# Altium schematic sheet MCU.SchDoc
size A3; DocumentNumber: 2; SheetNumber: 2; SheetTotal: 5
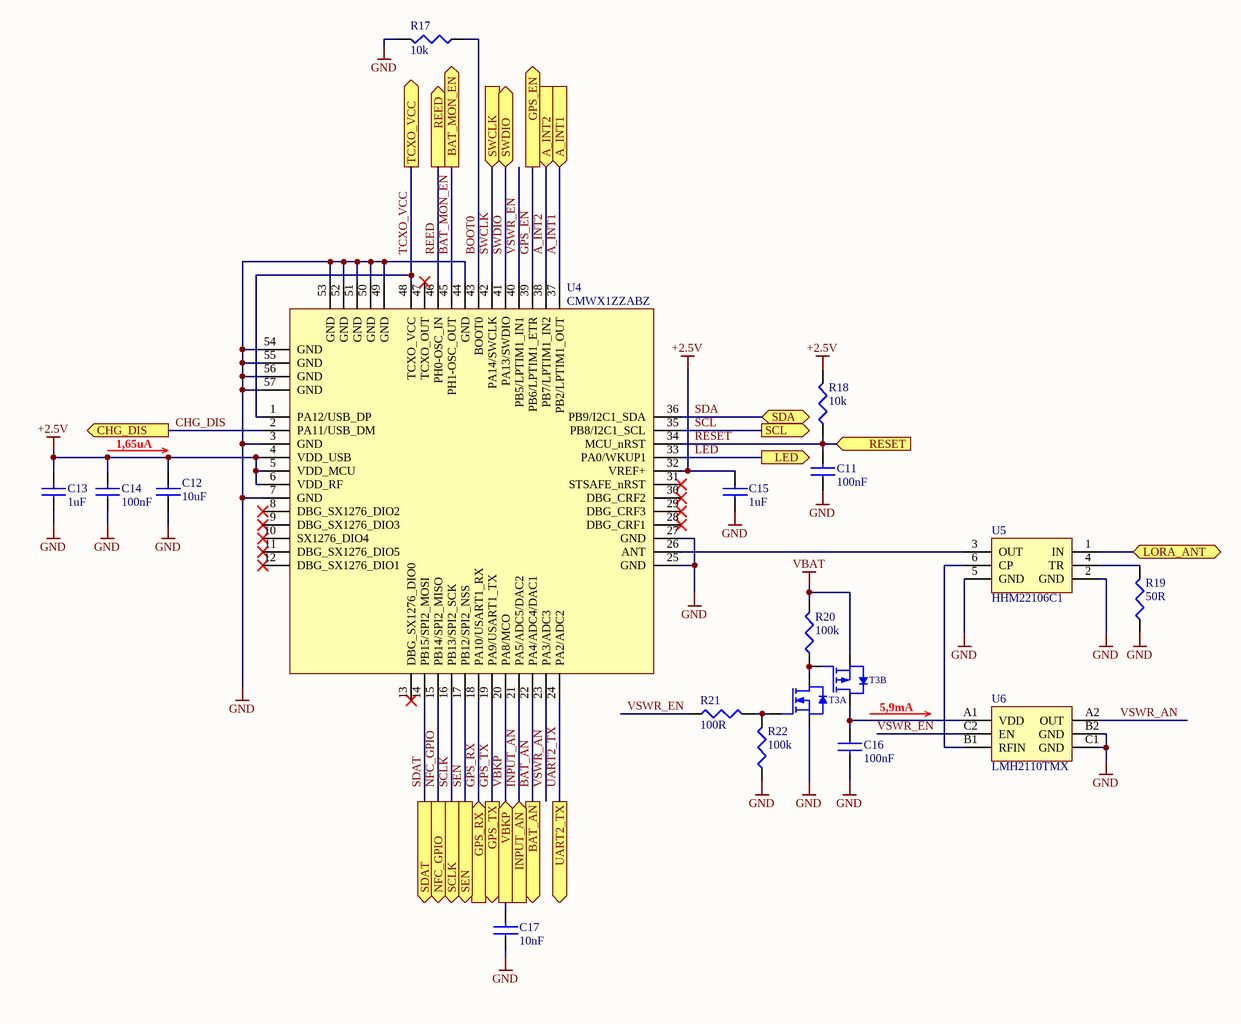
[diagram p0: MCU.SchDoc]

## Parts
C11  100nF  [CAP0402]
C12  10uF  [CAP0603]
C13  1uF  [CAP0402]
C14  100nF  [CAP0402]
C15  1uF  [CAP0402]
C16  100nF  [CAP0402]
C17  10nF  [CAP0402]
R17  10k  [RES0402]
R18  10k  [RES0402]
R19  50R  [RES0402]
R20  100k  [RES0402]
R21  100R  [RES0402]
R22  100k  [RES0402]
T3  VT6M1T2CR  [VMT6]  (value not drawn)  (parts A,B of 2)
U4  CMWX1ZZABZ  [Lora Module ES0]
U5  HHM22106C1  [HHM22106C1]
U6  LMH2110TMX  [DSBGA-6]

## Ports
A_INT1 (in), A_INT2 (in), BAT_AN (out), BAT_MON_EN (out), CHG_DIS (out), GPS_EN (out), GPS_RX (in), GPS_TX (out), INPUT_AN (in), LED (out), LORA_ANT (bidir), NFC_GPIO (out), REED (out), RESET (in), SCL (out), SCLK (out), SDA (bidir), SDAT (out), SEN (out), SWCLK (in), SWDIO (bidir), TCXO_VCC (out), UART2_TX (out), VBKP (out)

## Nets
+2.5V: C12.2 C13.2 C14.2 C15.2 R18.2 U4.4(VDD_USB) U4.5(VDD_MCU) U4.6(VDD_RF) U4.32(VREF+)
GND: C11.1 C12.1 C13.1 C14.1 C15.1 C16.2 C17.1 R17.2 R19.1 R22.1 T3.1(S1) U4.3(GND) U4.7(GND) U4.25(GND) U4.27(GND) U4.44(GND) U4.49(GND) U4.50(GND) U4.51(GND) U4.52(GND) U4.53(GND) U4.54(GND) U4.55(GND) U4.56(GND) U4.57(GND) U5.2(GND) U5.5(GND) U6.B2(GND) U6.C1(GND)
VBAT: R20.2 T3.4(S2)
A_INT1: U4.37(PB2/LPTIM1_OUT) ; port A_INT1
A_INT2: U4.38(PB7/LPTIM1_IN2) ; port A_INT2
BAT_AN: U4.22(PA4/ADC4/DAC1) ; port BAT_AN
BAT_MON_EN: U4.45(PH1-OSC_OUT) ; port BAT_MON_EN
BOOT0: R17.1 U4.43(BOOT0)
CHG_DIS: U4.2(PA11/USB_DM) ; port CHG_DIS
GPS_EN: U4.39(PB6/LPTIM1_ETR) ; port GPS_EN
GPS_RX: U4.18(PA10/USART1_RX) ; port GPS_RX
GPS_TX: U4.19(PA9/USART1_TX) ; port GPS_TX
INPUT_AN: U4.21(PA5/ADC5/DAC2) ; port INPUT_AN
LED: U4.33(PA0/WKUP1) ; port LED
LORA_ANT: U5.1(IN) ; port LORA_ANT
NFC_GPIO: U4.15(PB14/SPI2_MISO) ; port NFC_GPIO
REED: U4.46(PH0-OSC_IN) ; port REED
RESET: C11.2 R18.1 U4.34(MCU_nRST) ; port RESET
SCL: U4.35(PB8/I2C1_SCL) ; port SCL
SCLK: U4.16(PB13/SPI2_SCK) ; port SCLK
SDA: U4.36(PB9/I2C1_SDA) ; port SDA
SDAT: U4.14(PB15/SPI2_MOSI) ; port SDAT
SEN: U4.17(PB12/SPI2_NSS) ; port SEN
SWCLK: U4.42(PA14/SWCLK) ; port SWCLK
SWDIO: U4.41(PA13/SWDIO) ; port SWDIO
TCXO_VCC: U4.1(PA12/USB_DP) U4.48(TCXO_VCC) ; port TCXO_VCC
UART2_TX: U4.24(PA2/ADC2) ; port UART2_TX
VBKP: C17.2 U4.20(PA8/MCO) ; port VBKP
VSWR_AN: U4.23(PA3/ADC3) U6.A2(OUT)
VSWR_EN: R21.1 U4.40(PB5/LPTIM1_IN1) U6.C2(EN)
NetC16_1: C16.1 T3.3(D2) U6.A1(VDD)
NetR19_2: R19.2 U5.4(TR)
NetR20_1: R20.1 T3.5(G2) T3.6(D1)
NetR21_2: R21.2 R22.2 T3.2(G1)
NetU4_26: U4.26(ANT) U5.3(OUT)
NetU5_6: U5.6(CP) U6.B1(RFIN)

Not connected (* = marked no-connect by the designer): U4 8(DBG_SX1276_DIO2)* 9(DBG_SX1276_DIO3)* 10(SX1276_DIO4)* 11(DBG_SX1276_DIO5)* 12(DBG_SX1276_DIO1)* 13(DBG_SX1276_DIO0)* 28(DBG_CRF1)* 29(DBG_CRF3)* 30(DBG_CRF2)* 31(STSAFE_nRST)* 47(TCXO_OUT)*

## Notes on the sheet
- 1,65uA
- 5,9mA
- Size: A3
- Revision:
- Sheet
- of

## Library data of the parts
C11 C14 C16 = C - 100nF/0402: MULTICOMP         MC0402X104J160CT             SMD Multilayer Ceramic Capacitor, 0402 [1005 Metric], 0.1 F, 16 V,  5%, X5R, MC Series                          New; IRNAS Part No.: /; Voltage Rating: 16V; Supplier 1: Farnell; Manufacturer: Multicomp; Manufacturer Part Number: MC0402X104J160CT; Stock 1: 3230; Pricing 1: 10=0.0139, 100=0.0108, 500=0.0076, 2500=0.0051, 5000=0.0038 (EUR); Case Code (Metric): 1005; Case Code (Imperial): 0402; Min Operating Temperature: -55°C; Max Operating Temperature: 85°C; Capacitance: 100nF; Dielectric: X5R; Packaging: Tape and Reel; Tolerance: 5%; Voltage Rating (DC): 16V; REACH SVHC: No SVHC; ComponentLink1URL: http://www.farnell.com/datasheets/2117933.pdf; ComponentLink1Description: http://www.farnell.com/datasheets/2117933.pdf; ComponentLink2URL: http://www.farnell.com/datasheets/2117900.pdf; ComponentLink2Description: http://www.farnell.com/datasheets/2117900.pdf; Supplier Part Number 1: 2627419
C12 = 10uF: 10uf/0603/20%; Manufacturer: KEMET; Manufacturer Part Number: C0603C106M8PACTU; Stock 1: 0; Pricing 1: 10=0.555, 100=0.315, 500=0.238, 1000=0.2, 2000=0.174, 4000=0.143, 20000=0.123 (GBP); Supplier 1: Farnell; Supplier Part Number 1: 2456110
C13 C15 = C - 1uF/0402: CAP CER 1UF 10V 20% X5R 0402; Manufacturer: Murata; Manufacturer Part Number: GRM155R61A105ME15D; IRNAS Part No.: /; Stock 1: 0; Pricing 1: 10=0.0379, 100=0.0266, 500=0.0156, 2500=0.0098, 5000=0.0083 (EUR); Mount: Surface Mount; Case/Package: 0402; Case Code (Metric): 1005; Case Code (Imperial): 0402; Min Operating Temperature: -55°C; Max Operating Temperature: 85°C; Capacitance: 1uF; Tolerance: 20%; Voltage Rating: 10V; Packaging: Tape and Reel; Package Quantity: 1; Dielectric: X5R; Voltage: 10V; Voltage Rating (DC): 10V; Length: 1mm; Height: 0.5mm; Width: 0.02inch; Thickness: 0.022inch; Depth: 0.5mm; Radiation Hardening: No; REACH SVHC: No SVHC; Lead Free: Lead Free; ComponentLink1URL: https://datasheet.ciiva.com/164/product-164665.pdf; ComponentLink1Description: https://datasheet.ciiva.com/164/product-164665.pdf; ComponentLink2URL: https://datasheet.ciiva.com/11616/product-11616508.pdf; ComponentLink2Description: https://datasheet.ciiva.com/11616/product-11616508.pdf; ComponentLink3URL: https://datasheet.ciiva.com/46418/1769893-46418047.pdf; ComponentLink3Description: https://datasheet.ciiva.com/46418/1769893-46418047.pdf; ComponentLink4URL: https://datasheet.ciiva.com/164/partnumbering-e-01-164666.pdf; ComponentLink4Description: https://datasheet.ciiva.com/164/partnumbering-e-01-164666.pdf; ComponentLink5URL: https://datasheet.ciiva.com/164/partnumbering-e-01-164667.pdf; ComponentLink5Description: https://datasheet.ciiva.com/164/partnumbering-e-01-164667.pdf; Supplier 1: Farnell; Supplier Part Number 1: 1740588
C17 = C - 10nF/0402: CAP CER 10000PF 16V X7R 0402; Manufacturer: Murata; Manufacturer Part Number: GRM155R71C103KA01D; IRNAS Part No.: /; Tolerance: 10%; Supplier 1: Farnell; Stock 1: 16478; Pricing 1: 10=0.0216, 100=0.0151, 500=0.0104, 2500=0.0069, 5000=0.0056 (EUR); Mount: Surface Mount; Case/Package: 0402; Number of Pins: 2; Case Code (Metric): 1005; Case Code (Imperial): 0402; Min Operating Temperature: -55°C; Max Operating Temperature: 125°C; Package Quantity: 1; Capacitance: 10nF; Voltage Rating: 16V; Packaging: Tape and Reel; Voltage Rating (DC): 16V; Dielectric: X7R; Termination: SMD/SMT; Voltage: 16V; Length: 1mm; Height: 0.5mm; Width: 0.02inch; Thickness: 0.022inch; Depth: 0.5mm; Radiation Hardening: No; REACH SVHC: No SVHC; Lead Free: Lead Free; ComponentLink1URL: https://datasheet.ciiva.com/129/partnumbering-e-01-129774.pdf; ComponentLink1Description: https://datasheet.ciiva.com/129/partnumbering-e-01-129774.pdf; ComponentLink2URL: https://datasheet.ciiva.com/129/partnumbering-e-01-129775.pdf; ComponentLink2Description: https://datasheet.ciiva.com/129/partnumbering-e-01-129775.pdf; ComponentLink3URL: https://datasheet.ciiva.com/129/product-129776.pdf; ComponentLink3Description: https://datasheet.ciiva.com/129/product-129776.pdf; ComponentLink4URL: https://datasheet.ciiva.com/18184/getdatasheetpartid-178863-18184649.pdf; ComponentLink4Description: https://datasheet.ciiva.com/18184/getdatasheetpartid-178863-18184649.pdf; ComponentLink5URL: https://datasheet.ciiva.com/22698/608985-22698415.pdf; ComponentLink5Description: https://datasheet.ciiva.com/22698/608985-22698415.pdf; ComponentLink6URL: https://datasheet.ciiva.com/7937/608985-7937614.pdf; ComponentLink6Description: https://datasheet.ciiva.com/7937/608985-7937614.pdf; Supplier Part Number 1: 1828864
R17 R18 = R - 10k/0402: MULTICOMP         MCWR04X1002FTL             SMD Chip Resistor, Thick Film, 10 kohm, 50 V, 0402 [1005 Metric], 62.5 mW,  1%, MCWR Series; IRNAS Part No.: I-100014; Resistance: 10kR; Voltage Rating: 50V; Power Rating: 62.5mW; Temperature Coefficient: 100ppm/°C; Supplier 1: Farnell; Manufacturer: Multicomp; Manufacturer Part Number: MCWR04X1002FTL; Stock 1: 602609; Pricing 1: 10=0.0029, 100=0.0017, 500=0.0012, 2500=0.001, 5000=0.0008 (EUR); Case/Package: 0402; Case Code (Metric): 1005; Case Code (Imperial): 0402; Packaging: Cut Tape; Composition: Thick Film; Tolerance: 1%; Voltage Rating (DC): 50V; REACH SVHC: No SVHC; ComponentLink1URL: http://www.farnell.com/datasheets/1849611.pdf; ComponentLink1Description: http://www.farnell.com/datasheets/1849611.pdf; Supplier Part Number 1: 2447096
R19 = R - 50R: SMD Chip Resistor, 0402 [1005 Metric], 50 ohm, FC Series, 30 V, Thin Film, 50 mW; Manufacturer: Vishay; Manufacturer Part Number: CRCW060351R0FKEA; IRNAS Part No.: /; Resistance: 51R; Tolerance: 1%; Power Rating: 100mW; Voltage Rating: 75V; Temperature Coefficient: 100ppm/°C; Stock 1: 1083; Pricing 1: 10=0.0116, 250=0.0087, 500=0.0059, 1250=0.0052, 2500=0.0046 (GBP); Case/Package: 0603; Number of Pins: 2; Weight: 7.1E-05oz; Case Code (Imperial): 0603; Case Code (Metric): 1608; Contact Plating: Tin; Min Operating Temperature: -55°C; Max Operating Temperature: 155°C; Packaging: Tape and Reel; Package Quantity: 10; Composition: Thick Film; Number of Terminations: 2; Military Standard: Not; Termination: SMD/SMT; Max Power Dissipation: 100mW; Voltage Rating (DC): 75V; Working Voltage: 75V; Length: 1.55mm; Height: 0.45mm; Width: 0.85mm; Depth: 0.85mm; Radiation Hardening: No; REACH SVHC: Unknown; Lead Free: Lead Free; ComponentLink11URL: http://www.farnell.com/datasheets/2045976.pdf?_ga=2.23751994.1451481302.1563774341-1373726713.1554121096&_gac=1.92491119.1562763802.CjwKCAjwmZbpBRAGEiwADrmVXm8xT8OHDZvJe8qZIQyyGmIuiUD-TEITatw0hIdDkyBwIXXCH7oneRoCl7cQAvD_BwE; ComponentLink11Description: Datasheet; Supplier 1: Farnell; Supplier Part Number 1: 2309101
R20 R22 = R - 100k/0402: MULTICOMP   MCWR04X1003FTL   RES, THICK FILM, 100KOHM, 1%, 0.0625W; IRNAS Part No.: I-100013; Resistance: 100kR; Power Rating: 62.5mW; Voltage Rating: 50V; Temperature Coefficient: 100ppm/°C; Supplier 1: Farnell; Manufacturer: Multicomp; Manufacturer Part Number: MCWR04X1003FTL; Stock 1: 161188; Pricing 1: 10=0.0029, 100=0.0017, 500=0.0012, 2500=0.001, 5000=0.0008 (EUR); Mount: Surface Mount; Case/Package: 0402; Case Code (Metric): 1005; Case Code (Imperial): 0402; Tolerance: 1%; Packaging: Cut Tape; Composition: Thick Film; Voltage Rating (DC): 50V; REACH SVHC: No SVHC; ComponentLink1URL: https://datasheet.ciiva.com/46386/1849611-46386524.pdf; ComponentLink1Description: https://datasheet.ciiva.com/46386/1849611-46386524.pdf; Supplier Part Number 1: 2447094
R21 = R - 100R/0402: MULTICOMP         MCMR04X1000FTL            SMD Chip Resistor, Ceramic, MCMR Series, 100 ohm, 50 V, 0402 [1005 Metric], 62.5 mW,  1%; IRNAS Part No.: /; Temperature Coefficient: 100ppm/°C; Power Rating: 62.5mW; Voltage Rating: 50V; Supplier 1: Farnell; Manufacturer: Multicomp; Manufacturer Part Number: MCMR04X1000FTL; Stock 1: 62365; Pricing 1: 10=0.0071, 100=0.0042, 500=0.003, 2500=0.0024, 5000=0.0019 (GBP); Case/Package: 0402; Case Code (Metric): 1005; Case Code (Imperial): 0402; Resistance: 100R; Tolerance: 1%; Composition: Ceramic; Packaging: Cut Tape; Voltage Rating (DC): 50V; REACH SVHC: No SVHC; ComponentLink1URL: https://datasheet.ciiva.com/28692/1716705-28692087.pdf; ComponentLink1Description: https://datasheet.ciiva.com/28692/1716705-28692087.pdf; ComponentLink2URL: https://datasheet.ciiva.com/22708/1716705-22708156.pdf; ComponentLink2Description: https://datasheet.ciiva.com/22708/1716705-22708156.pdf; Supplier Part Number 1: 2072515
T3 = T_M - VT6M1T2CR: Dual MOSFET, N and P Channel, 100 mA, 20 V, 2.5 ohm, 4.5 V, 1 V; ELRAD Id sifra / ELRAD Id No: 597778; Opis / Description: MOSFET BSS123       /N-Channel; Komp / Device: SMD; Value: BSS123; Velikost / Size: SOT23; FIT: 0.44; Author: Ciril Golob; Date: 11.07.2018; ComponentLINK1Description: Datasheet; ComponentLINK2Description: Datasheet www; ComponentLINK1URL: c:\ELRADSVN\Altium_Library\Libraries\Active\Datasheet\BSS123.pdf; ComponentLINK2URL: http://www.onsemi.com/pub/Collateral/BSS123-D.PDF; ComponentLink1Description: Datasheet; ComponentLink1URL: http://www.farnell.com/datasheets/2198041.pdf?_ga=2.191543850.1451481302.1563774341-1373726713.1554121096&_gac=1.95045230.1562763802.CjwKCAjwmZbpBRAGEiwADrmVXm8xT8OHDZvJe8qZIQyyGmIuiUD-TEITatw0hIdDkyBwIXXCH7oneRoCl7cQAvD_BwE; Supplier 1: Farnell; Supplier Part Number 1: 2706721
U4 = MCU - CMWX1ZZABZ: RF Module, FSK, OOK, LoRa, 4.8Kbps, 915MHz, -135.5dBm, 2.2V to 3.6V, I2C, SPI, UART, USB; Manufacturer: Murata; Manufacturer Part Number: CMWX1ZZABZ-091; Stock 1: 175; Pricing 1: 1=11.7, 5=11.06, 10=9.94, 50=9.54, 100=9.14, 250=8.05 (GBP); ComponentLink1Description: Datasheet; ComponentLink1URL: D:\altium\Altium_Library\Active\Datasheet\CMWX1ZZABZ.pdf; Supplier 1: Mouser; Supplier Part Number 1: 81-CMWX1ZZABZ-091
U5 = RF - HHM22106C1: Signal Conditioning DIRECTIONAL COUPLER 700-2700MHz; Manufacturer: u-blox; Manufacturer Part Number: MAX-M8Q-0; Stock 1: 10805; ComponentLink1Description: Datasheet; ComponentLink1URL: https://eu.mouser.com/datasheet/2/400/f_coupler_hhm22106c1_en-1308651.pdf; Supplier 1: Mouser; Supplier Part Number 1: 810-HHM22106C1
U6 = RF - LMH2110TMX: RF Detector IC GSM, EDGE, CDMA 50MHz ~ 8GHz -40dBm ~ 5dBm ±0,5dB; Manufacturer: u-blox; Manufacturer Part Number: MAX-M8Q-0; Stock 1: 10805; ComponentLink1Description: Datasheet; ComponentLink1URL: http://www.ti.com/lit/ds/symlink/lmh2110.pdf; Supplier 1: Mouser; Supplier Part Number 1: 926-LMH2110TMX/NOPB